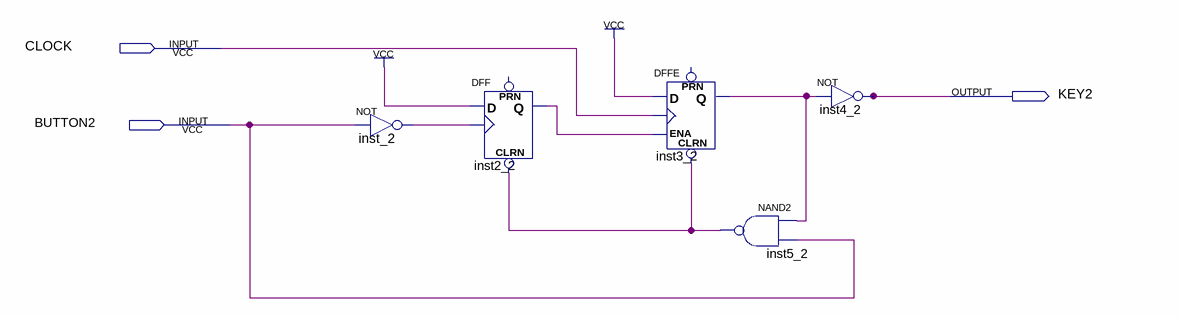
[diagram p0: schematic sheet]
// Quartus schematic Button_Debounce2.bdf as structural Verilog: 5 symbols, 3 pins
module Button_Debounce2 (
  input  CLOCK,
  input  BUTTON2,
  output KEY2
);

  wire inst2_2_q, inst3_2_q, inst5_2_out, inst_2_out;

  not inst_2 (inst_2_out, BUTTON2);
  DFF inst2_2 (.CLRN(inst5_2_out), .CLK(inst_2_out), .D(1'b1), .Q(inst2_2_q));  // open: PRN
  DFFE inst3_2 (.CLRN(inst5_2_out), .D(1'b1), .CLK(CLOCK), .ENA(inst2_2_q), .Q(inst3_2_q));  // open: PRN
  nand inst5_2 (inst5_2_out, inst3_2_q, BUTTON2);
  not inst4_2 (KEY2, inst3_2_q);
endmodule
